# EAGLE design temperature (EAGLE 8.3.2)
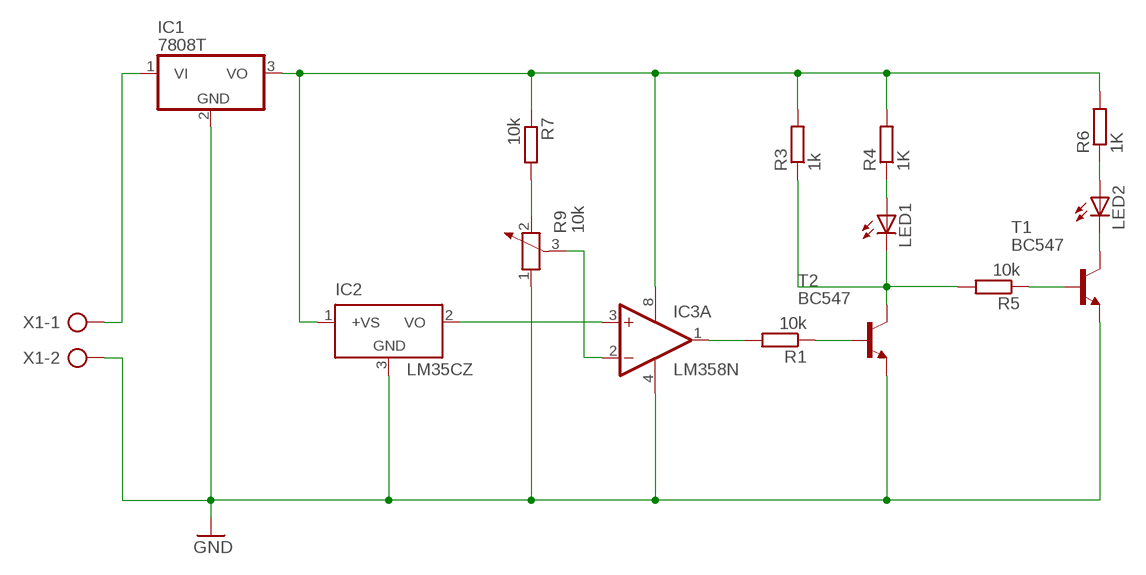
[diagram p0: schematic, sheet 1]

## Parts
IC1  7808T  [TO220H]
IC2  LM35CZ  [TO92]
IC3  LM358N  [DIL08]
LED1  LED5MM  [LED5MM]
LED2  LED5MM  [LED5MM]
R1  10k  R-EU_0204/7  [0204/7]
R3  1k  R-EU_0204/7  [0204/7]
R4  1K  R-EU_0204/7  [0204/7]
R5  10k  R-EU_0204/7  [0204/7]
R6  1K  R-EU_0204/7  [0204/7]
R7  10k  R-EU_0204/7  [0204/7]
R9  10k  POTENTIOMETER_PT-10  [PT-10]
T1  BC547  [TO92]
T2  BC547  [TO92]
X1  AK300/2  [AK300/2]

## Nets
GND: IC1.2(GND) IC2.3(GND) IC3.4(P:V-) R9.1 T1.1(E) T2.1(E) X1.2
N$1: IC1.1(VI) X1.1
N$2: IC1.3(VO) IC2.1(+VS) IC3.8(P:V+) R3.2 R4.2 R6.2 R7.1
N$3: R7.2 R9.2
N$5: IC2.2(VO) IC3.3(A:+IN)
N$6: IC3.2(A:-IN) R9.3
N$7: IC3.1(A:OUT) R1.2
N$8: R1.1 T2.2(B)
N$9: LED1.K(C) R3.1 R5.2 T2.3(C)
N$10: LED1.A R4.1
N$11: LED2.K(C) T1.3(C)
N$12: LED2.A R6.1
N$14: R5.1 T1.2(B)
Unconnected: IC3.5(B:+IN) IC3.6(B:-IN) IC3.7(B:OUT)

## Library data of the parts
IC1 = linear:78*: Positive VOLTAGE REGULATOR Source: http://cache.national.com/ds/LM/LM78L05.pdf http://www.fairchildsemi.com/ds/LM/LM7805.pdf
IC2 = lm35:LM35: Single-Supply Centigrade Temperature Sensor Vout = (10mV/°C x Temp °C) +5mmmV Source: http://www.national.com/ds/LM/LM35.pdf
IC3 = linear:LM358: OP AMP also LM158; LM258; LM2904 Source: http://cache.national.com/ds/LM/LM158.pdf
LED1 LED2 = led:LED: LED OSRAM: - CHIPLED LG R971, LG N971, LY N971, LG Q971, LY Q971, LO R971, LY R971 LH N974, LH R974 LS Q976, LO Q976, LY Q976 LO Q996 - Hyper CHIPLED LW Q18S LB Q993, LB Q99A, LB R99A - SideLED LS A670, LO A670, LY A670, LG A670, LP A670 LB A673, LV A673, LT A673, LW A673 LH A674 LY A675 LS A676, LA A676, LO A676, LY A676, LW A676 LS A679, LY A679, LG A679 - Hyper Micro SIDELED® LS Y876, LA Y876, LO Y876, LY Y876 LT Y87S - SmartLED LW L88C, LW L88S LB L89C, LB L89S, LG L890 LS L89K, LO L89K, LY L89K LS L896, LA L896, LO L896, LY L896 - TOPLED LS T670, LO T670, LY T670, LG T670, LP T670 LSG T670, LSP T670, LSY T670, LOP T670, LYG T670 LG T671, LOG T671, LSG T671 LB T673, LV T673, LT T673, LW T673 LH T674 LS T676, LA T676, LO T676, LY T676, LB T676, LH T676, LSB T676, LW T676 LB T67C, LV T67C, LT T67C, LS T67K, LO T67K, LY T67K, LW E67C LS E67B, LA E67B, LO E67B, LY E67B, LB E67C, LV E67C, LT E67C LW T67C LS T679, LY T679, LG T679 LS T770, LO T770, LY T770, LG T770, LP T770 LB T773, LV T773, LT T773, LW T773 LH T774 LS E675, LA E675, LY E675, LS T675 LS T776, LA T776, LO T776, LY T776, LB T776 LHGB T686 LT T68C, LB T68C - Hyper Mini TOPLED® LB M676 - Mini TOPLED Santana® LG M470 LS M47K, LO M47K, LY M47K Source: http://www.osram.convergy.de LUXEON: - LUMILED® LXK2-PW12-R00, LXK2-PW12-S00, LXK2-PW14-U00, LXK2-PW14-V00 LXK2-PM12-R00, LXK2-PM12-S00, LXK2-PM14-U00 LXK2-PE12-Q00, LXK2-PE12-R00, LXK2-PE12-S00, LXK2-PE14-T00, LXK2-PE14-U00 LXK2-PB12-K00, LXK2-PB12-L00, LXK2-PB12-M00, LXK2-PB14-N00, LXK2-PB14-P00, LXK2-PB14-Q00 LXK2-PR12-L00, LXK2-PR12-M00, LXK2-PR14-Q00, LXK2-PR14-R00 LXK2-PD12-Q00, LXK2-PD12-R00, LXK2-PD12-S00 LXK2-PH12-R00, LXK2-PH12-S00 LXK2-PL12-P00, LXK2-PL12-Q00, LXK2-PL12-R00 Source: www.luxeon.com KINGBRIGHT: KA-3528ASYC Source: www.kingbright.com
R1 R3-R7 = rcl:R-EU_: RESISTOR, European symbol
R9 = rcl:POTENTIOMETER_: Potentiometer
T1 T2 = transistor:BC547: NPN TRANSISTOR
X1 = con-ptr500:AK300/2: CONNECTOR; OC_FARNELL: unknown; OC_NEWARK: unknown

## Board
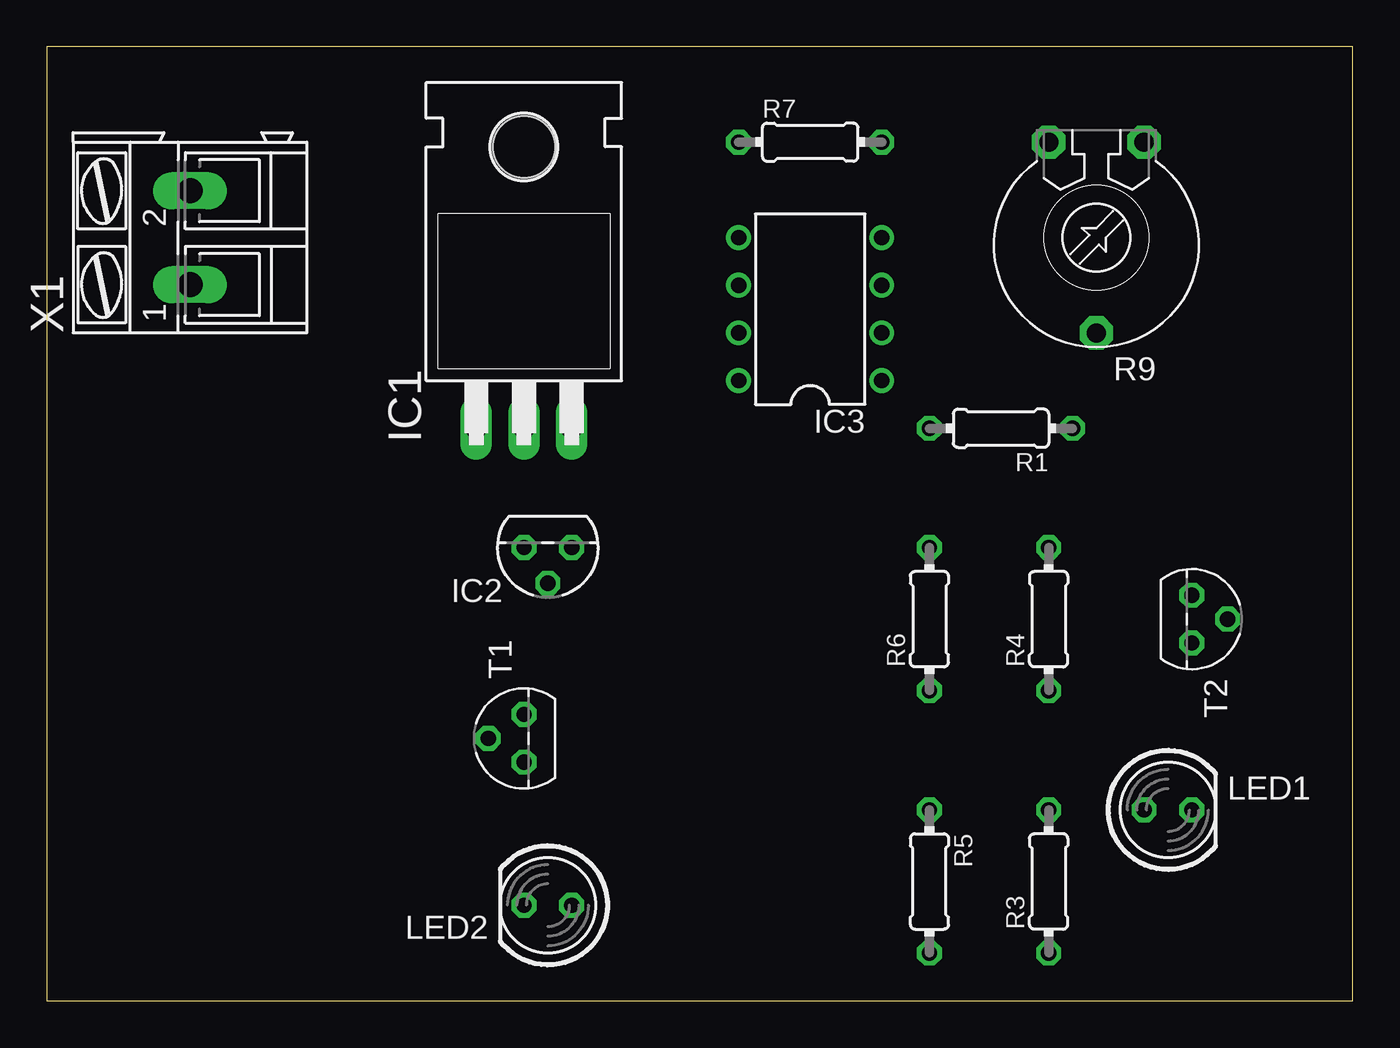
[diagram p1: board, top side]
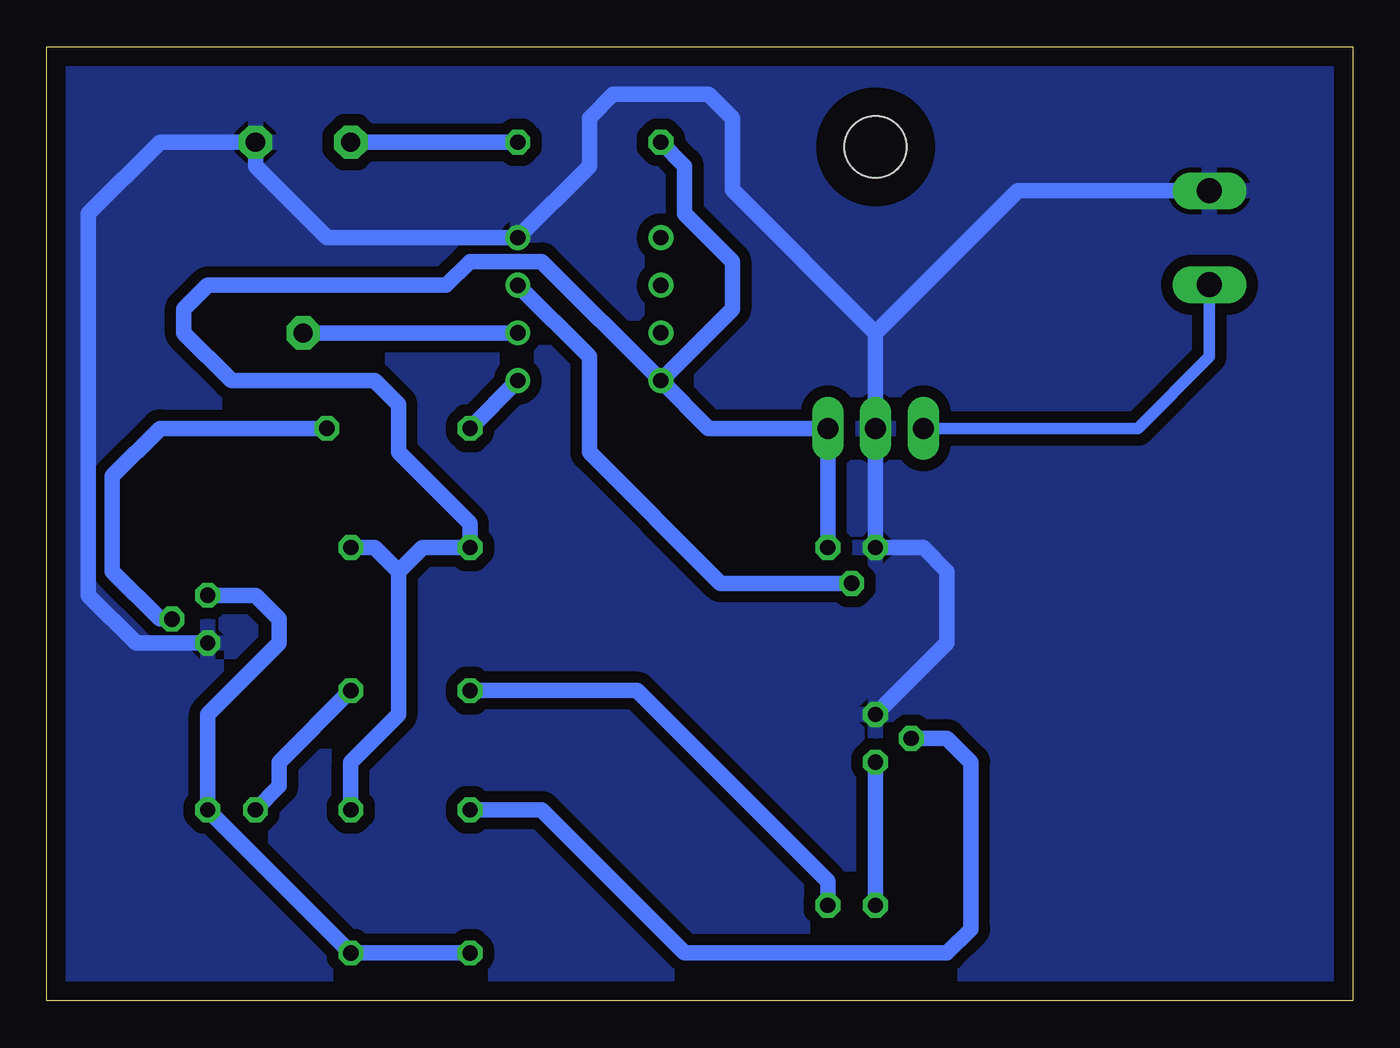
[diagram p2: board, bottom side, seen from below]

Size 69.52 x 50.79 mm. Coordinates in mm from the lower left corner, seen from the top.
Outline: 0,0 69.52,0 69.52,50.79 0,50.79 0,0
Copper layers (1*16): Top 0.035mm / dielectric 1.5mm / Bottom 0.035mm
Design rules "default": minimum track width 6mil, minimum drill 0.35mm, track to track 6mil, track to pad 6mil, pad to pad 6mil, via to via 6mil, smd to smd 6mil, copper to edge 40mil, drill to drill 6mil, minimum pad ring 10mil, minimum via ring 8mil, stop-mask expansion 4mil, vias tented up to drill 0mil, thermal gap 10mil

### Footprints (pad centres in the part's own frame; a part is rotated, then mirrored left to right if it is on the bottom)
TO220H = drill 1.118 long: 1 -2.54,-10.16; 2 0,-10.16; 3 2.54,-10.16 | hole 3.302: 0,4.826
TO92 = drill 0.813 octagon: 1 -1.27,0; 2 0,1.905; 3 1.27,0
DIL08 = drill 0.813 pad 1.27: 1 -3.81,-3.81; 2 -1.27,-3.81; 3 1.27,-3.81; 4 3.81,-3.81; 5 3.81,3.81; 6 1.27,3.81; 7 -1.27,3.81; 8 -3.81,3.81
LED5MM = drill 0.813 octagon: A -1.27,0; K 1.27,0
0204/7 = drill 0.813 octagon: 1 -3.81,0; 2 3.81,0
PT-10 = drill 1.016 pad 1.778 octagon: 1 -2.54,-5.08; 2 2.54,-5.08; 3 0,5.08
TO92' = drill 0.813 octagon: 1 1.27,0; 2 0,1.905; 3 -1.27,0
AK300/2 = drill 1.321 long: 1 -2.515,0; 2 2.489,0

### Placement (x,y rotation side)
IC1  25.4,40.64 0 top
IC2  26.67,24.13 180 top
IC3  40.64,36.83 90 top
LED1  59.69,10.16 0 top
LED2  26.67,5.08 180 top
R1  50.8,30.48 180 top
R3  53.34,6.35 90 top
R4  53.34,20.32 90 top
R5  46.99,6.35 270 top
R6  46.99,20.32 90 top
R7  40.64,45.72 0 top
R9  55.88,40.64 180 top
T1  BC547  [TO92']  25.4,13.97 90 top
T2  BC547  [TO92']  60.96,20.32 270 top
X1  7.62,40.64 90 top

### Tracks (layer width: path | path; a pad name or v marks a point on that pad's centre or on a via)
GND
  Bottom 0.813: X1.2 17.83,43.13 25.4,35.56 | 25.4,35.56 IC1.2 IC2.3 22.86,24.13 21.59,22.86 21.59,19.05 T1.1 | T2.1 64.77,19.05 67.31,21.59 67.31,41.91 63.5,45.72 R9.1 58.42,44.45 54.61,40.64 IC3.4 40.64,44.45 40.64,46.99 39.37,48.26 34.29,48.26 33.02,46.99 33.02,43.18 25.4,35.56
  pour Bottom (isolate 0.61): 0.61,50.24 68.88,50.24 68.88,0.66 69.09,0.46 0.61,0.46
N$1
  Bottom 0.61: X1.1 7.62,34.29 11.43,30.48 IC1.1
N$2
  Bottom 0.813: R3.2 53.34,12.7 50.8,15.24 50.8,22.86 | 50.8,22.86 52.07,24.13 R4.2 | 50.8,22.86 49.53,24.13 R6.2 46.99,25.4 50.8,29.21 50.8,31.75 52.07,33.02 59.69,33.02 62.23,35.56 62.23,36.83 60.96,38.1 48.26,38.1 46.99,39.37 43.18,39.37 IC3.8 | IC2.1 IC1.3 34.29,30.48 IC3.8 | R7.1 35.56,44.45 35.56,41.91 33.02,39.37 33.02,36.83 IC3.8
N$3
  Bottom 0.813: R9.2 R7.2
N$5
  Bottom 0.813: IC2.2 33.66,22.23 40.64,29.21 40.64,34.29 IC3.3
N$6
  Bottom 0.813: R9.3 IC3.2
N$7
  Bottom 0.813: R1.2 IC3.1
N$8
  Bottom 0.813: T2.2 63.5,20.32 66.04,22.86 66.04,27.94 63.5,30.48 R1.1
N$9
  Bottom 0.813: R5.2 R3.1 LED1.K 60.96,15.24 57.15,19.05 57.15,20.32 58.42,21.59 T2.3
N$10
  Bottom 0.813: R4.1 57.15,12.7 57.15,11.43 LED1.A
N$11
  Bottom 0.813: LED2.K T1.3
N$12
  Bottom 0.813: LED2.A 27.94,6.35 38.1,16.51 R6.1
N$14
  Bottom 0.813: R5.1 43.18,10.16 35.56,2.54 21.59,2.54 20.32,3.81 20.32,12.7 21.59,13.97 T1.2